# Altium schematic sheet Programadapter.SchDoc
size A4
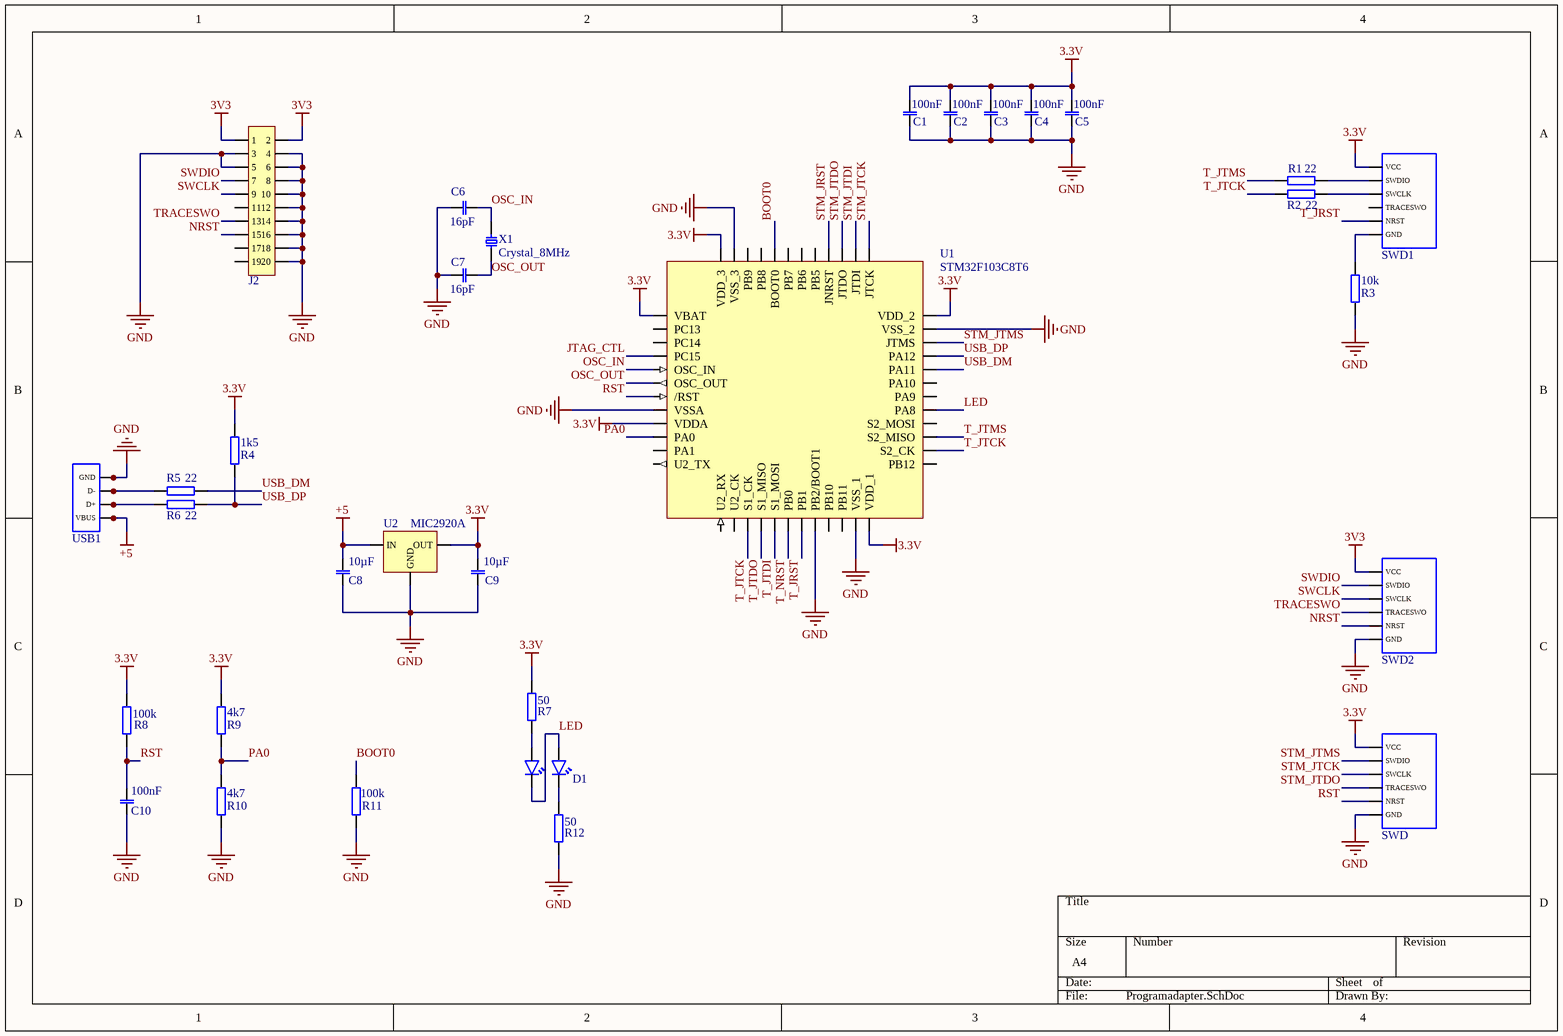
[diagram p0: Programadapter.SchDoc]

## Parts
C1  Capacity: 100nF  [C_0603_Chip2PinSM127P600-8N]  (hidden comment: Capacitor_0603)
C2  Capacity: 100nF  [C_0603_Chip2PinSM127P600-8N]  (hidden comment: Capacitor_0603)
C3  Capacity: 100nF  [C_0603_Chip2PinSM127P600-8N]  (hidden comment: Capacitor_0603)
C4  Capacity: 100nF  [C_0603_Chip2PinSM127P600-8N]  (hidden comment: Capacitor_0603)
C5  Capacity: 100nF  [C_0603_Chip2PinSM127P600-8N]  (hidden comment: Capacitor_0603)
C6  Capacity: 16pF  [C_0603_Chip2PinSM127P600-8N]  (hidden comment: Capacitor_0603)
C7  Capacity: 16pF  [C_0603_Chip2PinSM127P600-8N]  (hidden comment: Capacitor_0603)
C8  Capacity: 10µF  [10uF_0805_Chip2PinSM127P600-8N]  (hidden comment: Capacitor_0805)
C9  Capacity: 10µF  [10uF_0805_Chip2PinSM127P600-8N]  (hidden comment: Capacitor_0805)
C10  Capacity: 100nF  [C_0603_Chip2PinSM127P600-8N]  (hidden comment: Capacitor_0603)
D1  LTST_LED_RED_GREEN  [LTST_LED_GREEN_RED]  (value not drawn)
J2  JTAG_Header  [JTAG_Header]  (value not drawn)
R1  Resistance: 22  [R_0603_Chip2PinSM127P600-8N]  (hidden comment: Resistor_0603)
R2  Resistance: 22  [R_0603_Chip2PinSM127P600-8N]  (hidden comment: Resistor_0603)
R3  Resistance: 10k  [R_0603_Chip2PinSM127P600-8N]  (hidden comment: Resistor_0603)
R4  Resistance: 1k5  [R_0603_Chip2PinSM127P600-8N]  (hidden comment: Resistor_0603)
R5  Resistance: 22  [R_0603_Chip2PinSM127P600-8N]  (hidden comment: Resistor_0603)
R6  Resistance: 22  [R_0603_Chip2PinSM127P600-8N]  (hidden comment: Resistor_0603)
R7  Resistance: 50  [R_0603_Chip2PinSM127P600-8N]  (hidden comment: Resistor_0603)
R8  Resistance: 100k  [R_0603_Chip2PinSM127P600-8N]  (hidden comment: Resistor_0603)
R9  Resistance: 4k7  [R_0603_Chip2PinSM127P600-8N]  (hidden comment: Resistor_0603)
R10  Resistance: 4k7  [R_0603_Chip2PinSM127P600-8N]  (hidden comment: Resistor_0603)
R11  Resistance: 100k  [R_0603_Chip2PinSM127P600-8N]  (hidden comment: Resistor_0603)
R12  Resistance: 50  [R_0603_Chip2PinSM127P600-8N]  (hidden comment: Resistor_0603)
SWD  ProgrammingHeader  [ProgrammingHeader]  (value not drawn)
SWD1  ProgrammingHeader  [ProgrammingHeader]  (value not drawn)
SWD2  ProgrammingHeader  [ProgrammingHeader]  (value not drawn)
U1  STM32F103C8T6  [STM32F103CBT_LQFP48]
U2  MIC2920A  [MIC2920A_SOT230P710X170-4N]
USB1  USB-C_simplified  [USB-C_receptacle]  (value not drawn)
X1  Crystal_8MHz  [Crystal_8MHz]

## Nets
3.3V: C1.1 C2.1 C3.1 C4.1 C5.1 C9.1 R4.2 R7.2 R8.2 R9.2 SWD.1(VCC) SWD1.1(VCC) U1.1(VBAT) U1.9(VDDA) U1.24(VDD_1) U1.36(VDD_2) U1.48(VDD_3) U2.3(OUT)
3V3: J2.1 J2.2 SWD2.1(VCC)
+5: C8.1 U2.1(IN) USB1.A4(VBUS) USB1.A9(VBUS) USB1.B4(VBUS) USB1.B9(VBUS)
GND: C1.2 C2.2 C3.2 C4.2 C5.2 C6.1 C7.1 C8.2 C9.2 C10.2 J2.3 J2.4 J2.5 J2.6 J2.8 J2.10 J2.12 J2.14 J2.16 J2.18 J2.20 R3.1 R10.1 R11.1 R12.1 SWD.6(GND) SWD2.6(GND) U1.8(VSSA) U1.20(PB2/BOOT1) U1.23(VSS_1) U1.35(VSS_2) U1.47(VSS_3) U2.2(GND) USB1.A1(GND) USB1.A12(GND) USB1.B1(GND) USB1.B12(GND)
BOOT0: R11.2 U1.44(BOOT0)
JTAG_CTL: U1.4(PC15)
LED: D1.2 D1.4 U1.29(PA8)
NRST: J2.15 SWD2.5(NRST)
OSC_IN: C6.2 U1.5(OSC_IN) X1.2
OSC_OUT: C7.2 U1.6(OSC_OUT) X1.1
PA0: R9.1 R10.2 U1.10(PA0)
RST: C10.1 R8.1 SWD.5(NRST) U1.7(/RST)
STM_JRST: U1.40(JNRST)
STM_JTCK: SWD.3(SWCLK) U1.37(JTCK)
STM_JTDI: U1.38(JTDI)
STM_JTDO: SWD.4(TRACESWO) U1.39(JTDO)
STM_JTMS: SWD.2(SWDIO) U1.34(JTMS)
SWCLK: J2.9 SWD2.3(SWCLK)
SWDIO: J2.7 SWD2.2(SWDIO)
T_JRST: SWD1.5(NRST) U1.19(PB1)
T_JTCK: R2.1 U1.15(S1_CK) U1.26(S2_CK)
T_JTDI: U1.17(S1_MOSI)
T_JTDO: U1.16(S1_MISO)
T_JTMS: R1.2 U1.27(S2_MISO)
T_NRST: U1.18(PB0)
TRACESWO: J2.13 SWD2.4(TRACESWO)
USB_DM: R5.2 U1.32(PA11)
USB_DP: R4.1 R6.2 U1.33(PA12)
NetD1_1: D1.1 R7.1
NetD1_3: D1.3 R12.2
NetR1_1: R1.1 SWD1.2(SWDIO)
NetR2_2: R2.2 SWD1.3(SWCLK)
NetR3_2: R3.2 SWD1.6(GND)
NetR5_1: R5.1 USB1.A7(D-) USB1.B7(D-)
NetR6_1: R6.1 USB1.A6(D+) USB1.B6(D+)

Not connected (* = marked no-connect by the designer): J2 11 17 19; SWD1 4(TRACESWO); U1 2(PC13) 3(PC14) 11(PA1) 12(U2_TX) 13(U2_RX) 14(U2_CK) 21(PB10) 22(PB11) 25(PB12) 28(S2_MOSI) 30(PA9) 31(PA10) 41(PB5) 42(PB6) 43(PB7) 45(PB8) 46(PB9)

## Library data of the parts
U2 = MIC2920_3V3_VoltageReg: ComponentLink1Description: Datasheet; ComponentLink1URL: http://ww1.microchip.com/downloads/en/DeviceDoc/mic2920.pdf; ComponentLink2Description: MIC2920A-3.3WS-TR - Digikey; ComponentLink2URL: https://www.digikey.ch/product-detail/de/microchip-technology/MIC2920A-3.3WS-TR/576-1116-1-ND/771849
USB1 = USB-C_simplified: USB Type C receptacle simplified with just data and supply pins; ComponentLink1Description: Datasheet (Drawing); ComponentLink1URL: https://www.amphenol-icc.com/media/wysiwyg/files/drawing/12401610e4x2a.pdf; ComponentLink2Description: USB - C, USB 3.1 Gen 2 - Digikey; ComponentLink2URL: https://www.digikey.ch/product-detail/de/amphenol-icc-commercial-products/12401610E4-2A/12401610E4-2ACT-ND/5775520
X1 = Crystal_8MHz: 8MHz Crystall SMD; ComponentLink1Description: Datasheet; ComponentLink1URL: https://ecsxtal.com/store/pdf/ecx-53r.pdf; ComponentLink2Description: ECS-.327-6-34QCN-TR - Digikey; ComponentLink2URL: https://www.digikey.ch/product-detail/de/ecs-inc/ECS-80-18-30-JGN-TR/XC2103CT-ND/5875587